# EAGLE design Atom_Multiout_Addon_Comp-9p (EAGLE 9.5.1)
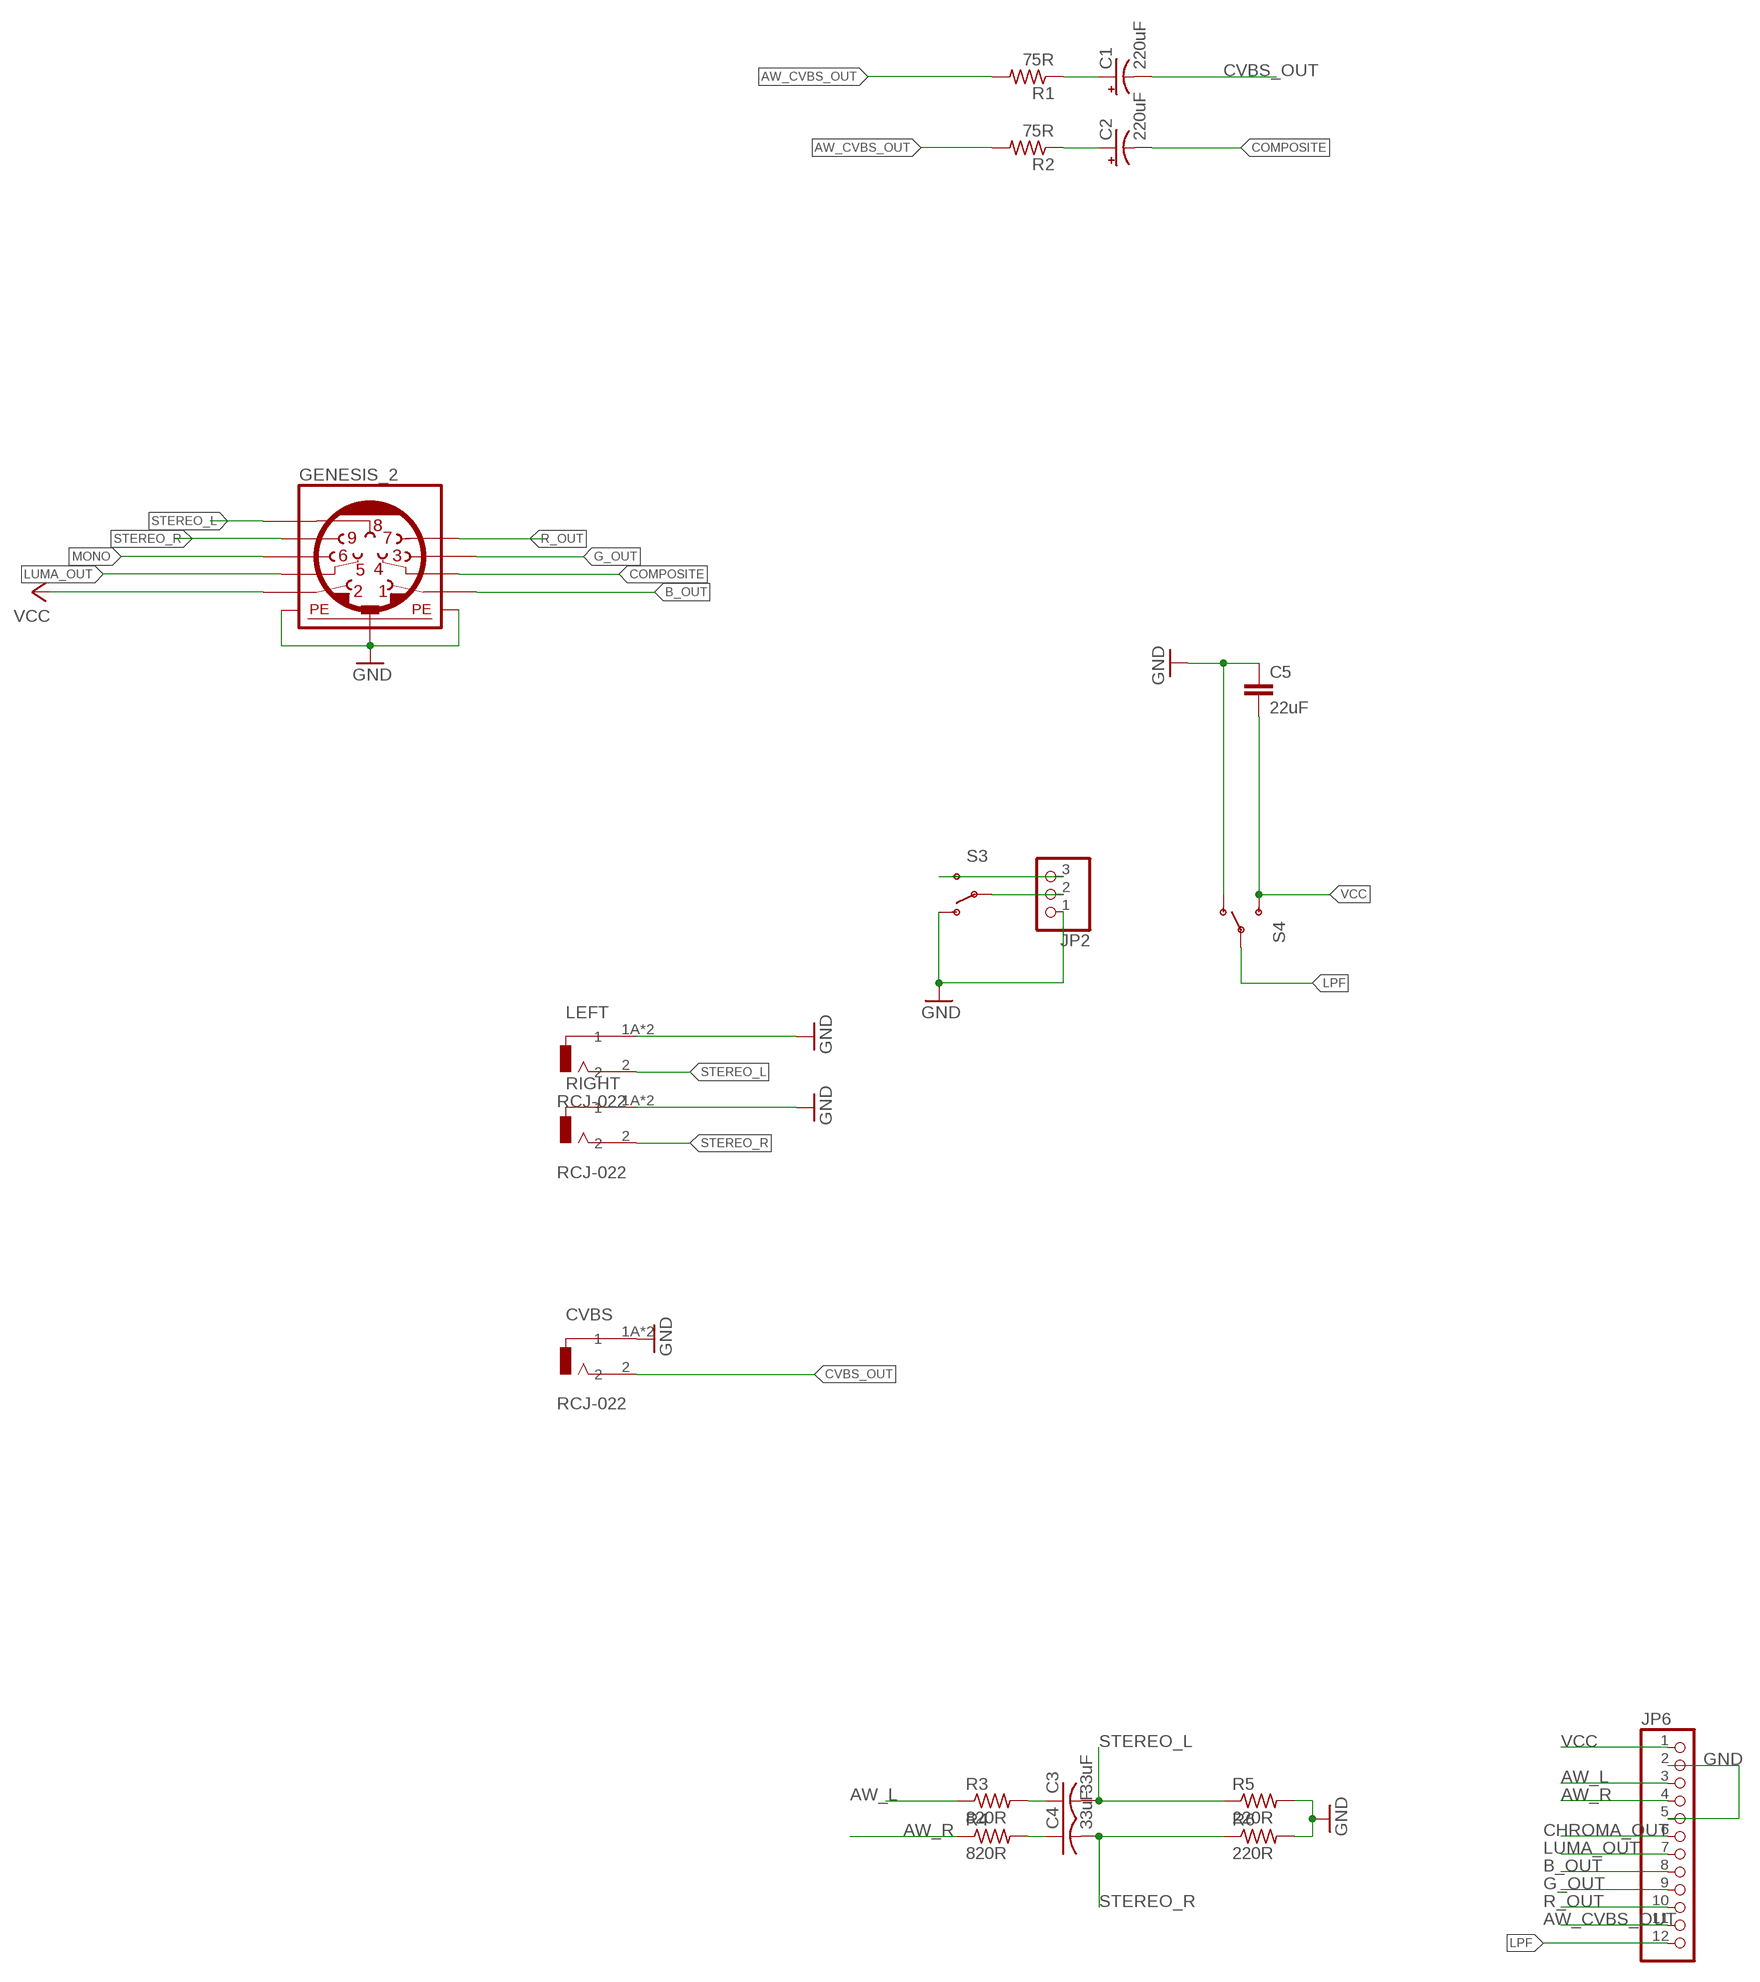
[diagram p0: schematic, sheet 1]

## Parts
C1  220uF  CPOL-USD/7343-31W  [D/7343-31W]
C2  220uF  CPOL-USD/7343-31W  [D/7343-31W]
C3  33uF  C-USC1206K  [C1206K]
C4  33uF  C-USC1206K  [C1206K]
C5  22uF  C-EUC0603  [C0603]
CVBS  RCJ-022  [CUI_RCJ-022]
GENESIS_2  MINI_DIN_9  [M_DIN9]
JP2  PINHD-1X03_2.54-S  [1X03-S]
JP6  PINHD-1X12_2.54-S  [1X12-S]
LEFT  RCJ-022  [CUI_RCJ-022]
R1  75R  R-US_R1206  [R1206]
R2  75R  R-US_R1206  [R1206]
R3  820R  R-US_R1206  [R1206]
R4  820R  R-US_R1206  [R1206]
R5  220R  R-US_R1206  [R1206]
R6  220R  R-US_R1206  [R1206]
RIGHT  RCJ-022  [CUI_RCJ-022]
S3  SWITCH-SPDT-SMD-A  [SWITCH-SPST-SMD-A]
S4  SWITCH-SPDT-SMD-A  [SWITCH-SPST-SMD-A]

## Nets
AW_CVBS_OUT: JP6.11 R1.2 R2.2
AW_L: JP6.3 R3.1
AW_R: JP6.4 R4.1
B_OUT: GENESIS_2.1 JP6.8
CHROMA_OUT: JP6.6
COMPOSITE: C2.- GENESIS_2.4
CVBS_OUT: C1.- CVBS.2
G_OUT: GENESIS_2.3 JP6.9
GND: C5.1 CVBS.1A CVBS.1B GENESIS_2.SH1(PE1) GENESIS_2.SH2(PE2) GENESIS_2.SH3(PE3) JP2.1 JP6.2 JP6.5 LEFT.1A LEFT.1B R5.2 R6.2 RIGHT.1A RIGHT.1B S3.1(O) S4.1(O)
LPF: JP6.12 S4.2(P)
LUMA_OUT: GENESIS_2.5 JP6.7
MONO: GENESIS_2.6
N$1: C2.+ R2.1
N$2: JP2.3 S3.3(S)
N$4: C1.+ R1.1
N$5: C4.1 R4.2
N$23: C3.1 R3.2
N$24: JP2.2 S3.2(P)
R_OUT: GENESIS_2.7 JP6.10
STEREO_L: C3.2 GENESIS_2.8 LEFT.2 R5.1
STEREO_R: C4.2 GENESIS_2.9 R6.1 RIGHT.2
VCC: C5.2 GENESIS_2.2 JP6.1 S4.3(S)

## Library data of the parts
C1 C2 = resistor:CPOL-US: POLARIZED CAPACITOR, American symbol
C3 C4 = resistor:C-US: CAPACITOR, American symbol
C5 = resistor:C-EU: CAPACITOR, European symbol
CVBS LEFT RIGHT = RCJ-022:RCJ-022: Metal Vertical RCA Jack, Red Insulator Check availability <https://pricing.snapeda.com/parts/RCJ-022/CUI%20Devices/view-part?ref=eda>; AVAILABILITY: In Stock; CUI_PURCHASE_URL: https://www.cuidevices.com/product/interconnect/connectors/rca-connectors/rcj-02-series?utm_source=snapeda.com&utm_medium=referral&utm_campaign=snapedaBOM; DESCRIPTION: 1 Port, Vertical, Through Hole, Shielded, RCA Jack Connector; MF: CUI Devices; MP: RCJ-022; PACKAGE: None; PRICE: None; PURCHASE-URL: https://pricing.snapeda.com/search/part/RCJ-022/?ref=eda
GENESIS_2 = mini_din:MINI_DIN_9
JP2 = pinhead-2:PINHD-1X03: PIN HEADER
JP6 = pinhead-2:PINHD-1X12: PIN HEADER
R1-R6 = resistor:R-US_: RESISTOR, American symbol
S3 S4 = SparkFun-Electromechanical:SWITCH-SPDT: SPDT Switch Simple slide switch, Spark Fun Electronics SKU : COM-00102 DPDT SMT slide switch, AYZ0202, SWCH-08179; PROD_ID: SWCH-10651

## Board
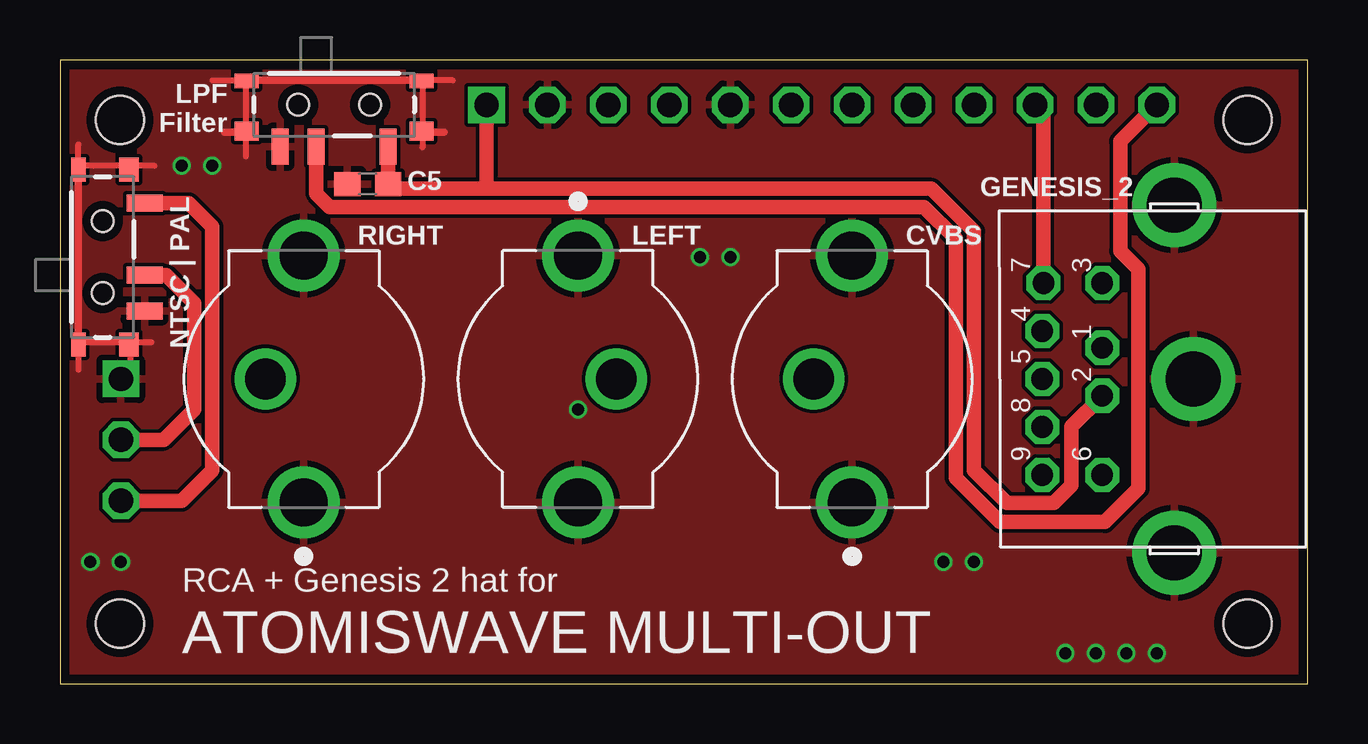
[diagram p1: board, top side]
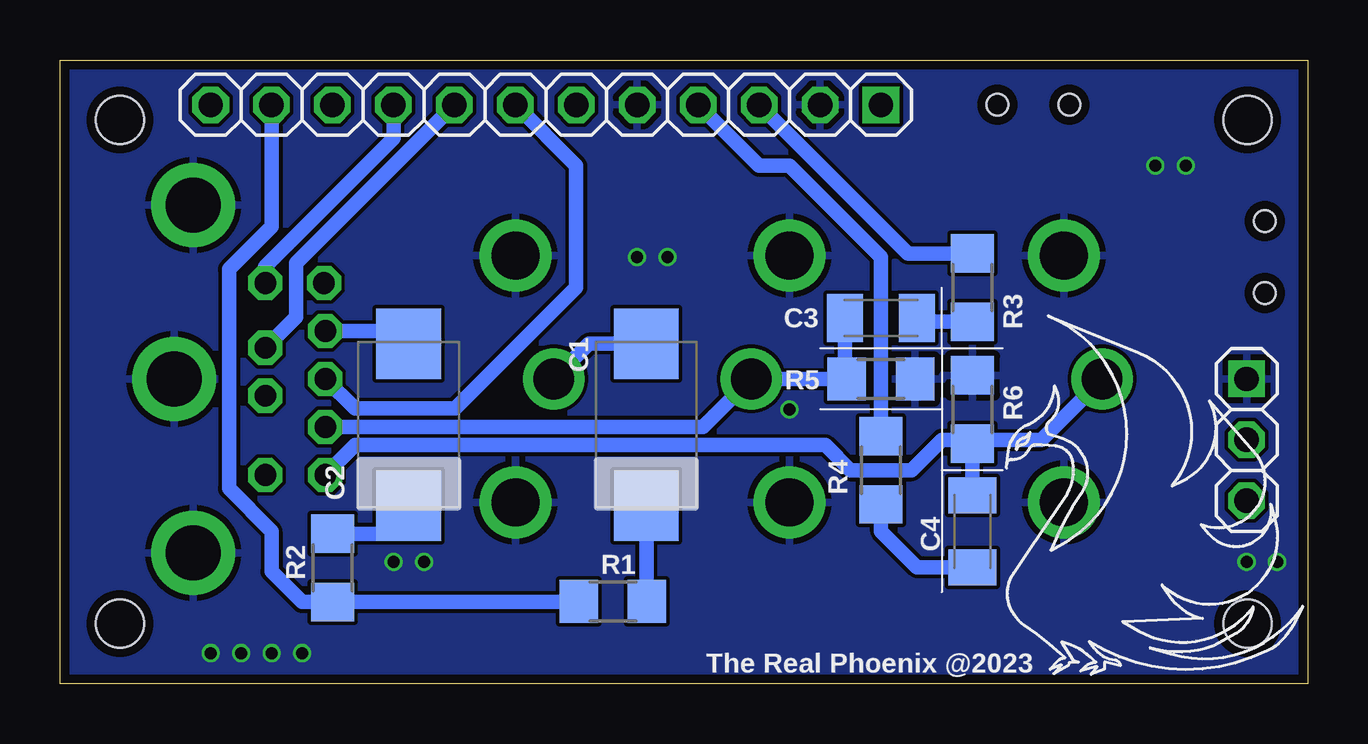
[diagram p2: board, bottom side, seen from below]

Size 52 x 26 mm. Coordinates in mm from the lower left corner, seen from the top.
Outline: 0,0 52,0 52,26 0,26 0,0
Copper layers (1*16): Top 0.035559375mm / dielectric 1.6mm / Bottom 0.035559375mm
Design rules "oshpark-2layer": minimum track width 6mil, minimum drill 10mil, track to track 6mil, track to pad 6mil, pad to pad 6mil, via to via 6mil, smd to smd 6mil, copper to edge 15mil, drill to drill 6mil, minimum pad ring 5mil, minimum via ring 5mil, stop-mask expansion 2.5mil, vias tented up to drill 30mil, thermal gap 10mil
Holes 2 mm at 49.5,23.5 2.5,23.5 2.5,2.5 49.5,2.5

### Footprints (pad centres in the part's own frame; a part is rotated, then mirrored left to right if it is on the bottom)
D/7343-31W = smd 2.95 x 2.7: + 3.375,0; - -3.375,0
C1206K = smd 1.5 x 2: 1 -1.5,0; 2 1.5,0
C0603 = smd 1.1 x 1: 1 -0.85,0; 2 0.85,0
CUI_RCJ-022 = drill 2: 1A -5.15,0; 1B 5.15,0 | drill 1.7: 2 0,1.6
M_DIN9 = drill 0.9 pad 1.422 octagon: 1 -1.3,-3.8; 2 0.7,-3.8; 3 -4,-3.8; 4 -2,-6.3; 5 0,-6.3; 6 4,-3.8; 7 -4,-6.25; 8 2,-6.3; 9 4,-6.3 | drill 2.3 pad 3.5: SH1 7.25,-0.8; SH2 0,0; SH3 -7.25,-0.8
1X03-S = drill 1.016 square: 1 -2.54,0 | drill 1.016 octagon: 2 0,0; 3 2.54,0
1X12-S = drill 1.016 square: 1 -13.97,0 | drill 1.016 octagon: 2 -11.43,0; 3 -8.89,0; 4 -6.35,0; 5 -3.81,0; 6 -1.27,0; 7 1.27,0; 8 3.81,0; 9 6.35,0; 10 8.89,0; 11 11.43,0; 12 13.97,0
R1206 = smd 1.6 x 1.803: 1 -1.422,0; 2 1.422,0
SWITCH-SPST-SMD-A = smd 0.7 x 1.5: 1 -2.25,-1.75; 2 -0.75,-1.75; 3 2.25,-1.75 | smd 1 x 0.6: GND1 -3.65,1; GND3 3.65,1 | smd 1 x 0.8: GND2 -3.65,-1.1; GND4 3.65,-1.1 | hole 0.9: -1.5,0; 1.5,0

### Placement (x,y rotation side)
C1  27.56,10.79 270 bottom
C2  37.47,10.79 270 bottom
C3  17.78,15.24 180 bottom
C4  13.97,6.35 90 bottom
C5  12.83,20.83 0 top
CVBS  33.02,12.7 90 top
GENESIS_2  47.24,12.7 270 top
JP2  2.54,10.16 270 bottom
JP6  31.75,24.13 180 bottom
LEFT  21.59,12.7 270 top
R1  28.96,3.43 180 bottom
R2  40.64,4.83 270 bottom
R3  13.97,16.51 270 bottom
R4  17.78,8.89 270 bottom
R5  17.78,12.7 0 bottom
R6  13.97,11.43 90 bottom
RIGHT  10.16,12.7 90 top
S3  1.78,17.78 90 top
S4  11.43,24.13 0 top
U$1  [LOGO]  16,-1.14 0 bottom

### Tracks (layer width: path | path; a pad name or v marks a point on that pad's centre or on a via)
AW_CVBS_OUT
  Bottom 0.61: JP6.11 43.18,19.05 44.96,17.27 44.96,8.13 43.18,6.35 43.18,4.67 41.91,3.4 R2.2 30.4,3.4 R1.2
AW_L
  Bottom 0.61: JP6.3 20.32,21.59 16.66,17.93 R3.1
AW_R
  Bottom 0.61: JP6.4 22.86,21.59 21.59,21.59 17.78,17.78 R4.1
B_OUT
  Bottom 0.61: GENESIS_2.1 42.16,15.28 42.16,17.53 JP6.8
COMPOSITE
  Bottom 0.61: GENESIS_2.4 37.99,14.7 C2.-
CVBS_OUT
  Bottom 0.61: C1.- 29.95,14.17 CVBS.2
G_OUT
  Bottom 0.61: GENESIS_2.3 43.44,17.39 38.1,22.73 JP6.9
GND  (via drill 0.5)
  Top 0.254: 3.94,21.59 1.4,21.59 0.76,21.59 | 0.76,21.59 0.76,22.48 | 3.81,14.22 2.92,14.22 | 2.92,14.22 0.76,14.22 0.76,13.08 | 2.92,14.22 2.92,12.7 | 6.35,25.15 7.75,25.15 7.75,23.11 7.75,22.99 7.75,21.97 | 16.38,25.15 15.11,25.15 15.11,22.99 15.11,22.35 | 0.76,21.46 0.76,21.59
  Top 0.305: 7.75,22.99 6.86,22.99 | 15.11,22.99 16,22.99 | 0.76,14.22 0.76,21.46 | 7.75,25.15 15.11,25.15
  other vias: 26.67,17.78 5.08,21.59 27.94,17.78 1.27,5.08 44.45,1.27 38.1,5.08 2.54,5.08 21.59,11.43 41.91,1.27 36.83,5.08 43.18,1.27 45.72,1.27 6.35,21.59
  pour Top: 0,26.67 53.34,26.67 53.34,0 0,0
  pour Bottom: 0,26.67 53.34,26.67 53.34,0 0,0
LPF
  Top 0.61: JP6.12 44.2,22.61 44.2,18.03 44.96,17.27 44.96,8.13 43.56,6.73 39.18,6.73 37.34,8.57 37.34,18.54 36.01,19.87 11.24,19.87 10.68,20.43 S4.2
LUMA_OUT
  Bottom 0.61: GENESIS_2.5 39.71,11.46 35.53,11.46 30.48,16.51 30.48,21.59 JP6.7
N$1
  Bottom 0.61: R2.1 38.64,6.25 C2.+
N$2
  Top 0.61: S3.3 5.37,20.03 6.35,19.05 6.35,8.89 5.08,7.62 JP2.3
N$4
  Bottom 0.61: R1.1 27.56,3.72 C1.+
N$5
  Bottom 0.61: C4.1 16.28,4.85 17.78,6.35 R4.2
N$23
  Bottom 0.61: R3.2 16.13,15.09 C3.1
N$24
  Top 0.61: S3.2 4.43,17.03 5.59,15.88 5.59,11.43 4.32,10.16 JP2.2
R_OUT
  Top 0.61: GENESIS_2.7 40.99,23.81 40.68,24.13 JP6.10
STEREO_L
  Bottom 0.61: GENESIS_2.8 25.19,10.7 LEFT.2 R5.1 19.28,12.7 C3.2
STEREO_R
  Bottom 0.61: C4.2 R6.1 | R6.1 13.82,10.16 11.1,10.16 RIGHT.2 | R6.1 14.12,10.16 15.24,10.16 16.51,8.89 19.05,8.89 20.1,9.94 39.71,9.94 GENESIS_2.9
VCC
  Top 0.61: GENESIS_2.2 42.16,10.72 42.16,8.27 41.43,7.53 39.46,7.53 38.1,8.89 38.1,18.86 36.33,20.63 17.78,20.63 | S4.3 C5.2 13.87,20.63 17.78,20.63 | JP6.1 17.78,20.63

### Text on the board
tPlace: LPF / Filter | NTSC | PAL | RCA + Genesis 2 hat for | ATOMISWAVE MULTI-OUT
bPlace: The Real Phoenix @2023